# Altium schematic sheet Isolated MCU Power Supply.SchDoc
size A4
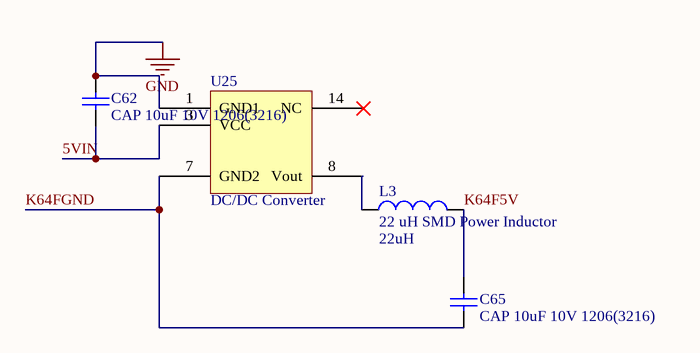
[diagram p0: Isolated MCU Power Supply.SchDoc]

## Parts
C62  CAP 10uF 10V 1206(3216)  [CAPC1206(3216)130_L]
C65  CAP 10uF 10V 1206(3216)  [CAPC1206(3216)130_L]
L3  22 uH SMD Power Inductor  value 22uH  [MURATA PS 8200 Series]
U25  DC/DC Converter  [MURATA PS NXE2]

## Nets
GND: C62.1 U25.1(GND1)
5VIN: C62.2 U25.3(VCC)
K64F5V: C65.1 L3.2
K64FGND: C65.2 U25.7(GND2)
NetL3_1: L3.1 U25.8(Vout)

Not connected (* = marked no-connect by the designer): U25 14(NC)*

## Library data of the parts
C62 C65 = CMP-1037-04970-1: CAP 10uF 10V -20% to +80% 1206 (3216 Metric) Thickness 1.3mm SMD; Case-Metric: 3216; Case-EIA: 1206; Value: 10uF; Rated Voltage: 10 V; Technology: SMT; Max Thickness: 1.3 mm; Tolerance: -20% to +80%
L3 = MURATA PS 82223C: 22 uH SMD Power Inductor, 0.32A RMS, Unshielded, 822 Series, MURATA Power Solutions; Published: 8-Jun-2000; LatestRevisionDate: 23 Nov 2018; LatestRevisionNote: N/A; PackageReference: LPS6235 SERIES; Publisher: Adrien Rapeaux; PackageDescription: 6mm x 6mm x 3.5mm; Code_JEITA: N/A; Code_IEC: N/A
U25 = MURATA PS NXE2: 5V-5V Isolated DC/DC Converter, 2W, 12.7 mm x 10.41 mm x 4.41 mm